# Altium schematic sheet 2.sensors.SchDoc: Sensor Schematic
size A; DocumentNumber: 2; Revision: V3; SheetNumber: 2; SheetTotal: 6
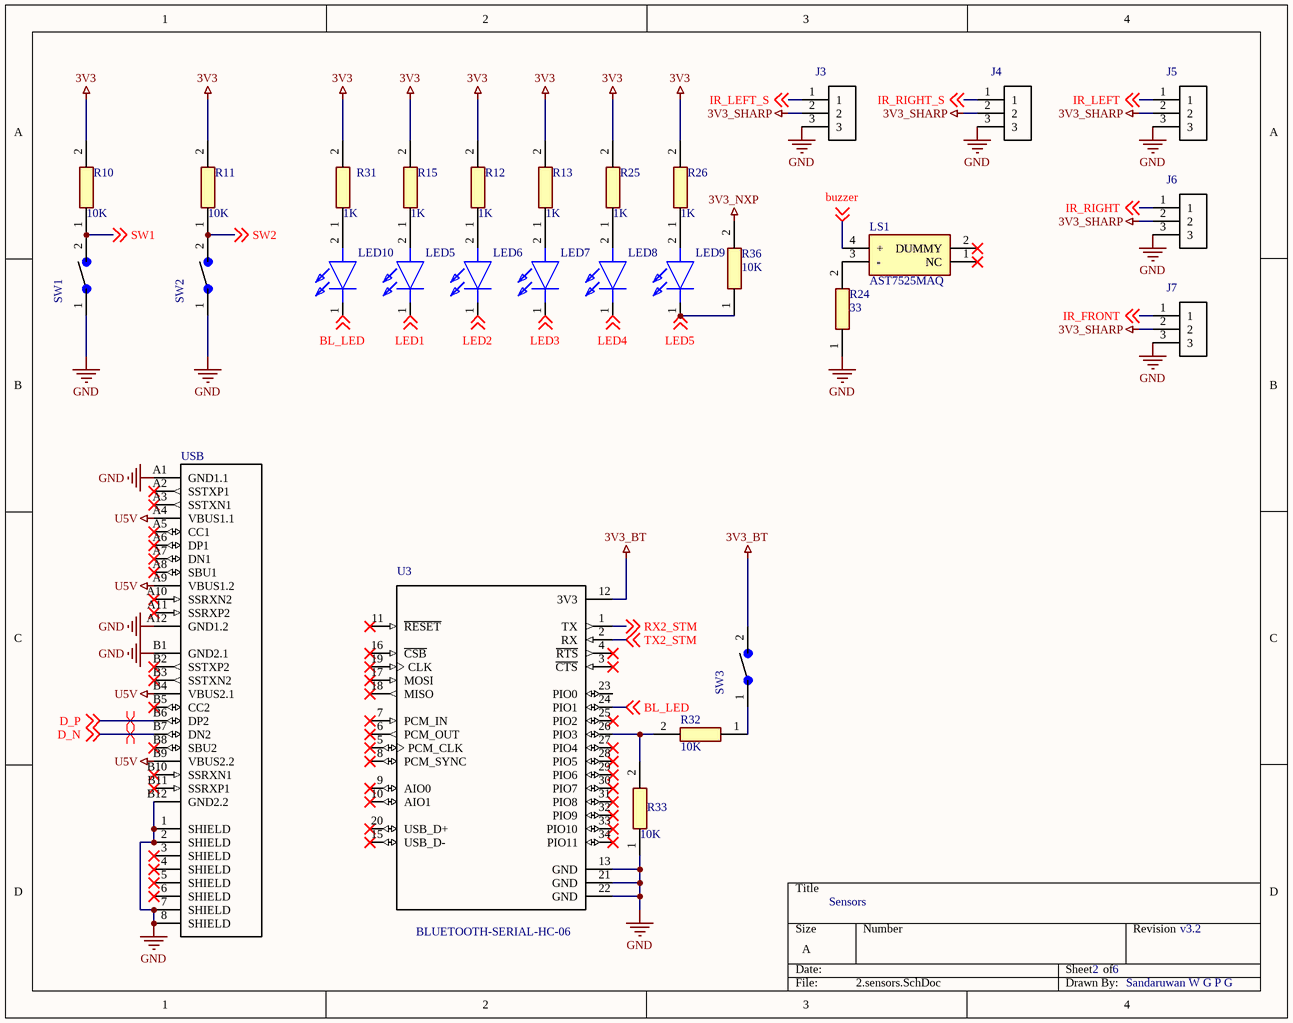
[diagram p0: 2.sensors.SchDoc]

## Parts
J3  0022057035_5268-03A  [*MOLEX_0022057035_5268-03A]  (value not drawn)
J4  0022057035_5268-03A  [*MOLEX_0022057035_5268-03A]  (value not drawn)
J5  0022057035_5268-03A  [*MOLEX_0022057035_5268-03A]  (value not drawn)
J6  0022057035_5268-03A  [*MOLEX_0022057035_5268-03A]  (value not drawn)
J7  0022057035_5268-03A  [*MOLEX_0022057035_5268-03A]  (value not drawn)
LED5  150080BS75000  [LEDC2012X80N]  (value not drawn)
LED6  150080BS75000  [LEDC2012X80N]  (value not drawn)
LED7  150080BS75000  [LEDC2012X80N]  (value not drawn)
LED8  150080BS75000  [LEDC2012X80N]  (value not drawn)
LED9  150080BS75000  [LEDC2012X80N]  (value not drawn)
LED10  150080BS75000  [LEDC2012X80N]  (value not drawn)
LS1  AST7525MAQ  [AST7525MAQ]
R10  value 10K  [RESC2012X65N]  (hidden comment: CPF0805B100KE)
R11  value 10K  [RESC2012X65N]  (hidden comment: CPF0805B100KE)
R12  value 1K  [RESC2012X65N]  (hidden comment: CPF0805B100KE)
R13  value 1K  [RESC2012X65N]  (hidden comment: CPF0805B100KE)
R15  value 1K  [RESC2012X65N]  (hidden comment: CPF0805B100KE)
R24  value 33  [RESC1608X55N]  (hidden comment: resistor)
R25  value 1K  [RESC2012X65N]  (hidden comment: CPF0805B100KE)
R26  value 1K  [RESC2012X65N]  (hidden comment: CPF0805B100KE)
R31  value 1K  [RESC2012X65N]  (hidden comment: CPF0805)
R32  value 10K  [RESC2012X65N]  (hidden comment: CPF0805)
R33  value 10K  [RESC2012X65N]  (hidden comment: CPF0805)
R36  value 10K  [RESC1608X55N]  (hidden comment: resistor)
SW1  1437566-3  [*TE_FSMSM]  (value not drawn)
SW2  1437566-3  [*TE_FSMSM]  (value not drawn)
SW3  1437566-3  [*TE_FSMSM]  (value not drawn)
U3  BLUETOOTH-SERIAL-HC-06  [*XCVR_BLUETOOTH-SERIAL-HC-06]
USB  USB4070-XX-X_REVC  [*GCT_USB4070-XX-X_REVC_USB4070-XX-X_REVC(Primary)]  (value not drawn)

## Nets
3V3: R10.2 R11.2 R12.2 R13.2 R15.2 R25.2 R26.2 R31.2
3V3_BT: SW3.2 U3.12(3V3)
3V3_NXP: R36.2
3V3_SHARP: J3.2 J4.2 J5.2 J6.2 J7.2
GND: J3.3 J4.3 J5.3 J6.3 J7.3 R24.1 R33.1 SW1.1 SW2.1 U3.13(GND) U3.21(GND) U3.22(GND) USB.1(SHIELD) USB.2(SHIELD) USB.7(SHIELD) USB.8(SHIELD) USB.A1(GND1.1) USB.A12(GND1.2) USB.B1(GND2.1) USB.B12(GND2.2)
U5V: USB.A4(VBUS1.1) USB.A9(VBUS1.2) USB.B4(VBUS2.1) USB.B9(VBUS2.2)
BL_LED: LED10.1(K) U3.24(PIO1) ; off-sheet BL_LED
buzzer: LS1.4(+) ; off-sheet buzzer
D_N: USB.B7(DN2) ; off-sheet D_N
D_P: USB.B6(DP2) ; off-sheet D_P
IR_FRONT: J7.1 ; off-sheet IR_FRONT
IR_LEFT: J5.1 ; off-sheet IR_LEFT
IR_LEFT_S: J3.1 ; off-sheet IR_LEFT_S
IR_RIGHT: J6.1 ; off-sheet IR_RIGHT
IR_RIGHT_S: J4.1 ; off-sheet IR_RIGHT_S
LED1: LED5.1(K) ; off-sheet LED1
LED2: LED6.1(K) ; off-sheet LED2
LED3: LED7.1(K) ; off-sheet LED3
LED4: LED8.1(K) ; off-sheet LED4
LED5: LED9.1(K) R36.1 ; off-sheet LED5
RX2_STM: U3.1(TX) ; off-sheet RX2_STM
SW1: R10.1 SW1.2 ; off-sheet SW1
SW2: R11.1 SW2.2 ; off-sheet SW2
TX2_STM: U3.2(RX) ; off-sheet TX2_STM
NetLED5_2: LED5.2(A) R15.1
NetLED6_2: LED6.2(A) R12.1
NetLED7_2: LED7.2(A) R13.1
NetLED8_2: LED8.2(A) R25.1
NetLED9_2: LED9.2(A) R26.1
NetLED10_2: LED10.2(A) R31.1
NetLS1_3: LS1.3(-) R24.2
NetR32_1: R32.1 SW3.1
NetR32_2: R32.2 R33.2 U3.26(PIO3)

Not connected (* = marked no-connect by the designer): LS1 1(NC)* 2(DUMMY)*; U3 3(~{CTS})* 4(~{RTS})* 5(PCM_CLK)* 6(PCM_OUT)* 7(PCM_IN)* 8(PCM_SYNC)* 9(AIO0)* 10(AIO1)* 11(~{RESET})* 15(USB_D-)* 16(~{CSB})* 17(MOSI)* 18(MISO)* 19(CLK)* 20(USB_D+)* 23(PIO0) 25(PIO2)* 27(PIO4)* 28(PIO5)* 29(PIO6)* 30(PIO7)* 31(PIO8)* 32(PIO9)* 33(PIO10)* 34(PIO11)*; USB 3(SHIELD)* 4(SHIELD)* 5(SHIELD)* 6(SHIELD)* A2(SSTXP1)* A3(SSTXN1)* A5(CC1)* A6(DP1)* A7(DN1)* A8(SBU1)* A10(SSRXN2)* A11(SSRXP2)* B2(SSTXP2)* B3(SSTXN2)* B5(CC2)* B8(SBU2)* B10(SSRXN1)* B11(SSRXP1)*

## Layout directives
differential pair: D_N, D_P

## Notes on the sheet
- Sensors
- v3.2
- Sandaruwan W G P G

## Library data of the parts
J3-J7 = 0022057035_5268-03A: Socket; wire-board; male; PIN: 3; 2.5mm; THT; SPOX; 3A; tinned; 20; MP: 0022057035 5268-03A; MF: Molex; Availability: Unavailable; Package: None; Price: None; SnapEDA_Link: https://www.snapeda.com/parts/0022057035%205268-03A/Molex/view-part/?ref=snap; Value: *
LED5-LED10 = 150080BS75000: LED; Manufacturer_Name: Wurth Elektronik; Datasheet Link: https://katalog.we-online.com/led/datasheet/150080BS75000.pdf; Height: 0.8mm; Manufacturer_Part_Number: 150080BS75000; Mouser Part Number: 710-150080BS75000; Mouser Price/Stock: https://www.mouser.com/Search/Refine.aspx?Keyword=710-150080BS75000; RS Part Number: 8154228P; RS Price/Stock: http://uk.rs-online.com/web/p/products/8154228P
LS1 = AST7525MAQ: Loudspeaker or Buzzer; Manufacturer_Name: Mallory Sonalert; Allied_Number: 70186690; Datasheet Link: https://www.mspindy.com/specifications/AST7525MAQ.PDF; Height: 2.5mm; Manufacturer_Part_Number: AST7525MAQ; Mouser Part Number: 539-AST7525MAQ; Mouser Price/Stock: https://www.mouser.com/Search/Refine.aspx?Keyword=539-AST7525MAQ; Allied Price/Stock: https://www.alliedelec.com/mallory-sonalert-ast7525maq/70186690/
R10-R13 R15 R25 R26 = CPF0805B100KE: Resistor; Manufacturer_Name: TE Connectivity; Allied_Number: 70286772; Datasheet Link: http://docs-europe.electrocomponents.com/webdocs/13d1/0900766b813d116f.pdf; Height: 0.65mm; Manufacturer_Part_Number: CPF0805B100KE; Mouser Part Number: 279-CPF0805B100KE; Mouser Price/Stock: https://www.mouser.com/Search/Refine.aspx?Keyword=279-CPF0805B100KE; RS Part Number: 6662673; RS Price/Stock: https://uk.rs-online.com/web/p/products/6662673; Allied Price/Stock: https://www.alliedelec.com/te-connectivity-cpf0805b100ke/70286772/
R31-R33 = CPF0805: Resistor; Manufacturer_Name: TE Connectivity; Manufacturer_Part_Number: CPF0805B100KE; Allied_Number: 70286772; Datasheet Link: http://docs-europe.electrocomponents.com/webdocs/13d1/0900766b813d116f.pdf; Height: 0.65mm; Mouser Part Number: 279-CPF0805B100KE; Mouser Price/Stock: https://www.mouser.com/Search/Refine.aspx?Keyword=279-CPF0805B100KE; RS Part Number: 6662673; RS Price/Stock: https://uk.rs-online.com/web/p/products/6662673; Allied Price/Stock: https://www.alliedelec.com/te-connectivity-cpf0805b100ke/70286772/
SW1-SW3 = FSMSM: Switch Tactile OFF _ON_ SPST Rectangular Button Gull Wing 0.05A 12VDC SMD Loose Piece; MF: TE Connectivity; Configuration_Pole-Throw: Single Pole - Single Throw; Contact_Current_Rating: 50 mA; Availability: Unavailable; Price: None; Package: None; SnapEDA_Link: https://www.snapeda.com/parts/FSMSM/TE%20Connectivity%20ALCOSWITCH%20Switches/view-part/?ref=snap; MP: FSMSM; TE_purchase_URL: https://www.te.com/usa-en/product-1437566-3.html?te_bu=Cor&te_type=disp&te_campaign=seda_glo_cor-seda-global-disp-prtnr-fy19-seda-model-bom-cta_sma-317_1&elqCampaignId=32493; Value: *
U3 = BLUETOOTH-SERIAL-HC-06: Bluetooth Modules _802.15.1_ BLUETOOTH-SERIAL-HC-06; MF: Olimex; Price: None; MP: BLUETOOTH-SERIAL-HC-06; Package: None; SnapEDA_Link: https://www.snapeda.com/parts/BLUETOOTH-SERIAL-HC-06/Olimex/view-part/?ref=snap; Availability: Unavailable; Value: *
USB = USB4070-XX-X_REVC: Usb Type c Rec. 30 , Vertical, Smt With Stakes & Pegs, Tray; MP: USB4070-30-B; MF: Global Connector Technology; SnapEDA_Link: https://www.snapeda.com/parts/USB4070-30-B/Global%20Connector%20Technology/view-part/?ref=snap; Package: None; Price: None; Availability: Unavailable; Value: *